# Altium schematic sheet [02] - BLOCK DIAGRAM.SchDoc
size A4; DocumentNumber: 2; SheetNumber: 2; SheetTotal: 5
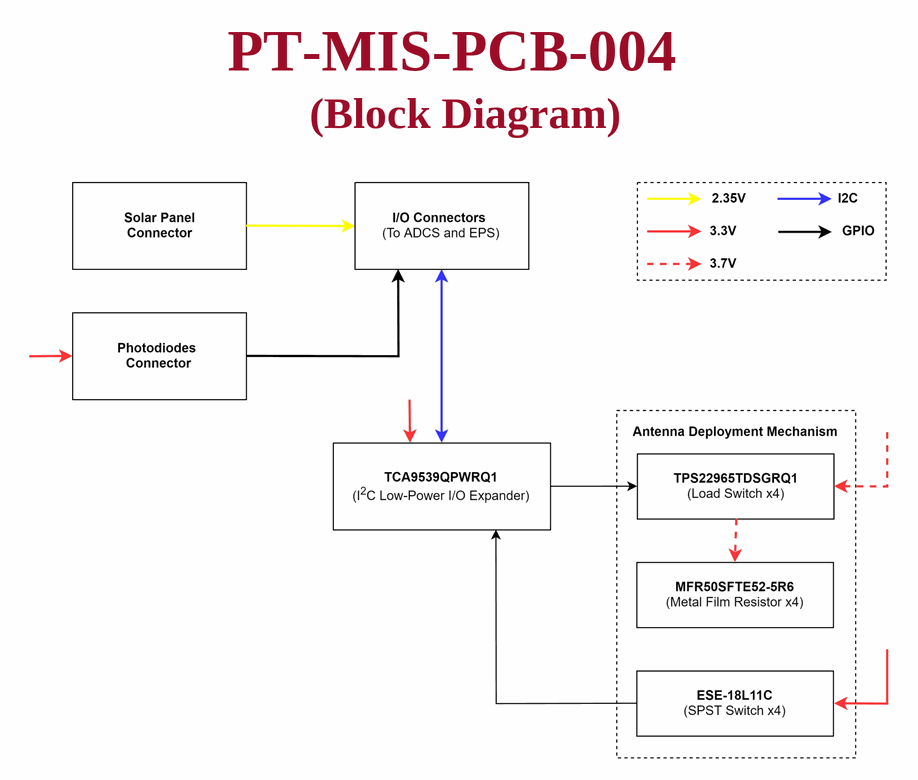
[diagram p0: [02] - BLOCK DIAGRAM.SchDoc]

## Notes on the sheet
- PT-MIS-PCB-004
- (Block Diagram)
- Project:
- Page Contents:
- Size:
- Revision:
- A4
- Document Number:
- Design:
- Date:
- Sheet
- of